# Altium schematic sheet Charger.SchDoc
size A4
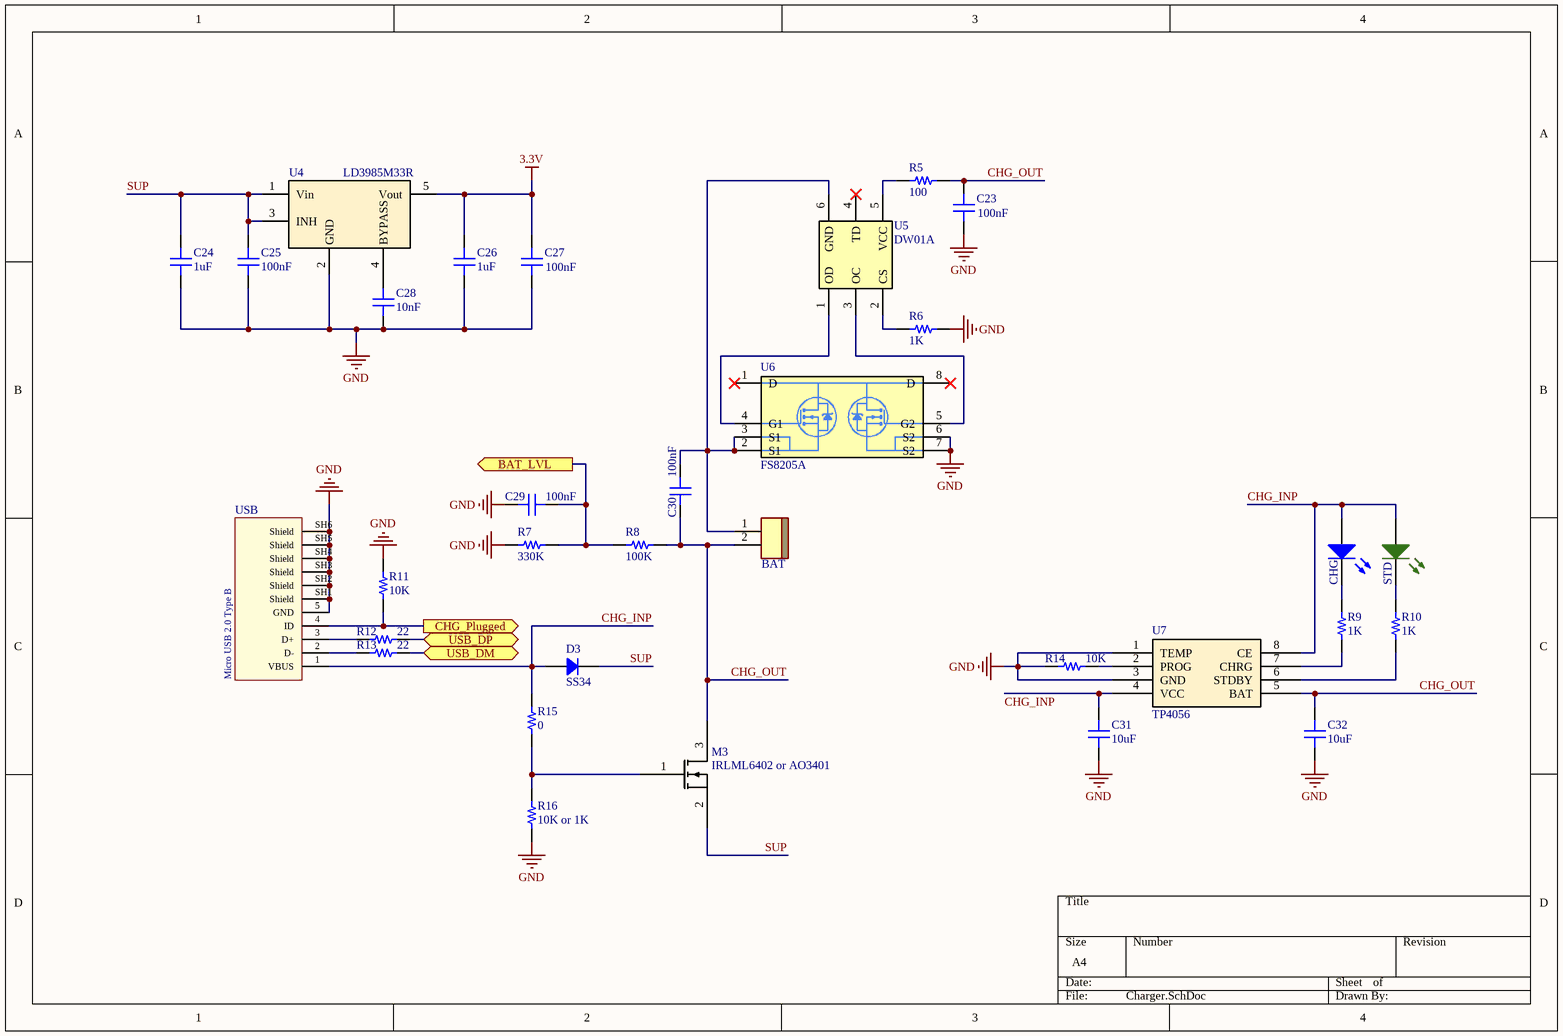
[diagram p0: Charger.SchDoc]

## Parts
BAT  JST BxB-PH-K 2Pin  [JST B2B-PH-K]  (value not drawn)
C23  100nF  [CAP 0603_1608]
C24  1uF  [CAP 0603_1608]
C25  100nF  [CAP 0603_1608]
C26  1uF  [CAP 0603_1608]
C27  100nF  [CAP 0603_1608]
C28  10nF  [CAP 0603_1608]
C29  100nF  [CAP 0603_1608]
C30  100nF  [CAP 0603_1608]
C31  10uF  [CAP 0603_1608]
C32  10uF  [CAP 0603_1608]
CHG  LED SMD 0603 BLUE  [LED_0603_RED]  (value not drawn)
D3  SS34  [DO-214AC SMA]
M3  IRLML6402 or AO3401  [SOT-23]
R5  100  [RES 0603_1608]
R6  1K  [RES 0603_1608]
R7  330K  [RES 0402_1005]
R8  100K  [RES 0402_1005]
R9  1K  [RES 0603_1608]
R10  1K  [RES 0603_1608]
R11  10K  [RES 0603_1608]
R12  22  [RES 0402_1005]
R13  22  [RES 0402_1005]
R14  10K  [RES 0603_1608]
R15  0  [RES 0603_1608]
R16  10K or 1K  [RES 0603_1608]
STD  LED SMD 0603 GREEN  [LED_0603_GREEN]  (value not drawn)
U4  LD3985M33R  [SOT23-5L]
U5  DW01A  [SOT-23-6pin]
U6  FS8205A  [TTSOP-8]
U7  TP4056  [SOIC-8]
USB  Micro USB 2.0 Type B  [USB_MICRO_B_BM_SHT]

## Ports
BAT_LVL (out), CHG_Plugged (out), USB_DM (bidir), USB_DP (bidir)

## Nets
3.3V: C26.2 C27.2 U4.5(Vout)
GND: C23.1 C24.1 C25.1 C26.1 C27.1 C28.1 C29.2 C31.2 C32.2 R6.1 R7.1 R11.2 R14.1 R16.1 U4.2(GND) U6.6(S2) U6.7(S2) U7.1(TEMP) U7.3(GND) USB.5(GND) USB.SH1(Shield) USB.SH2(Shield) USB.SH3(Shield) USB.SH4(Shield) USB.SH5(Shield) USB.SH6(Shield)
BAT_LVL: C29.1 R7.2 R8.1 ; port BAT_LVL
CHG_INP: C31.1 CHG.1(A) D3.1 R15.2 STD.1(A) U7.4(VCC) U7.8(CE) USB.1(VBUS)
CHG_OUT: BAT.2 C23.2 C30.2 C32.1 M3.3 R5.2 R8.2 U7.5(BAT)
CHG_Plugged: R11.1 USB.4(ID) ; port CHG_Plugged
SUP: C24.2 C25.2 D3.2 M3.2 U4.1(Vin) U4.3(INH)
USB_DM: R13.2 ; port USB_DM
USB_DP: R12.2 ; port USB_DP
NetBAT_1: BAT.1 C30.1 U5.6(GND) U6.2(S1) U6.3(S1)
NetC28_2: C28.2 U4.4(BYPASS)
NetCHG_2: CHG.2(K) R9.2
NetM3_1: M3.1 R15.1 R16.2
NetR5_1: R5.1 U5.5(VCC)
NetR6_2: R6.2 U5.2(CS)
NetR9_1: R9.1 U7.7(CHRG)
NetR10_1: R10.1 U7.6(STDBY)
NetR10_2: R10.2 STD.2(K)
NetR12_1: R12.1 USB.3(D+)
NetR13_1: R13.1 USB.2(D-)
NetR14_2: R14.2 U7.2(PROG)
NetU5_1: U5.1(OD) U6.4(G1)
NetU5_3: U5.3(OC) U6.5(G2)

Not connected (* = marked no-connect by the designer): U5 4(TD)*; U6 1(D)* 8(D)*

## Library data of the parts
BAT = JST BxB-PH-K 2Pin: Connector Header Through Hole 0.079" (2.00mm); PartNumber: B2B-PH-K-S(LF)(SN)
C23-C32 = Cap 0603: SMT Capacitor
  C23 C25 C27 C29 C30: VALUE: 100nF
  C24 C26: VALUE: 1uF
  C28: VALUE: 10nF
  C31 C32: VALUE: 10uF
D3 = US1M (SMD SMA): Diode Standard 1000V 1A Surface Mount SMA; PartNumber: SS34
M3 = 2N7002A: Name: IRLML6402 or AO3401
R5 R6 R9-R11 R14-R16 = Res 0603: SMT Resistor
  R5: VALUE: 100
  R6 R9 R10: VALUE: 1K
  R11 R14: VALUE: 10K
  R15: VALUE: 0
  R16: VALUE: 10K or 1K
R7 R8 R12 R13 = Res 0402: SMT Resistor
  R7: VALUE: 330K
  R8: VALUE: 100K
  R12 R13: VALUE: 22
U4 = LD3985M33R: 3.3V LDO Regulatoe
USB = Micro USB 2.0 Type B Horizonta (SMD) UB-MC5BR3-SD204-4S-1-TB NMP: USB - micro B  Receptacle Connector 5 Position Surface Mount, Right Angle; PartNumber: UB-MC5BR3-SD204-4S-1-TB NMP